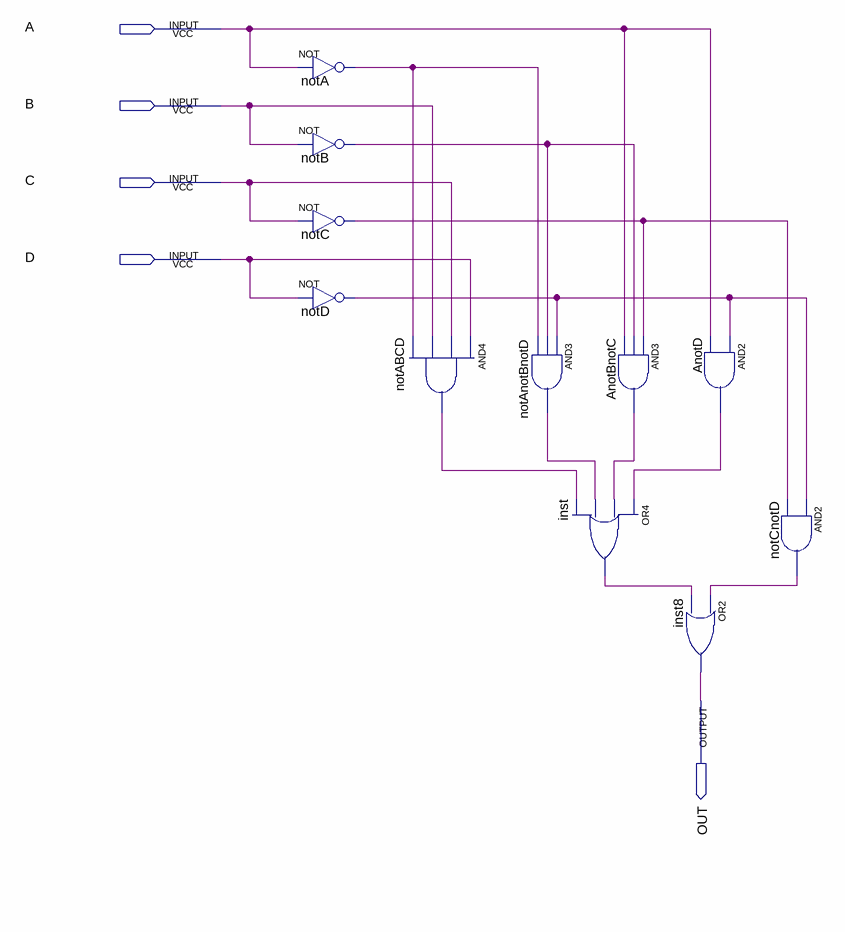
[diagram p0: schematic sheet]
// Quartus schematic labThree.bdf as structural Verilog: 11 symbols, 5 pins
module labThree (
  input  A,
  input  B,
  input  C,
  input  D,
  output OUT
);

  wire AnotBnotC_out, AnotD_out, inst_out, notA_out, notABCD_out, notAnotBnotD_out, notB_out, notC_out,
       notCnotD_out, notD_out;

  not notA (notA_out, A);
  not notB (notB_out, B);
  not notC (notC_out, C);
  not notD (notD_out, D);
  and notABCD (notABCD_out, D, C, B, notA_out);
  and notAnotBnotD (notAnotBnotD_out, notD_out, notB_out, notA_out);
  and AnotBnotC (AnotBnotC_out, notC_out, notB_out, A);
  or inst (inst_out, AnotD_out, AnotBnotC_out, notAnotBnotD_out, notABCD_out);
  and AnotD (AnotD_out, notD_out, A);
  or inst8 (OUT, notCnotD_out, inst_out);
  and notCnotD (notCnotD_out, notD_out, notC_out);
endmodule
